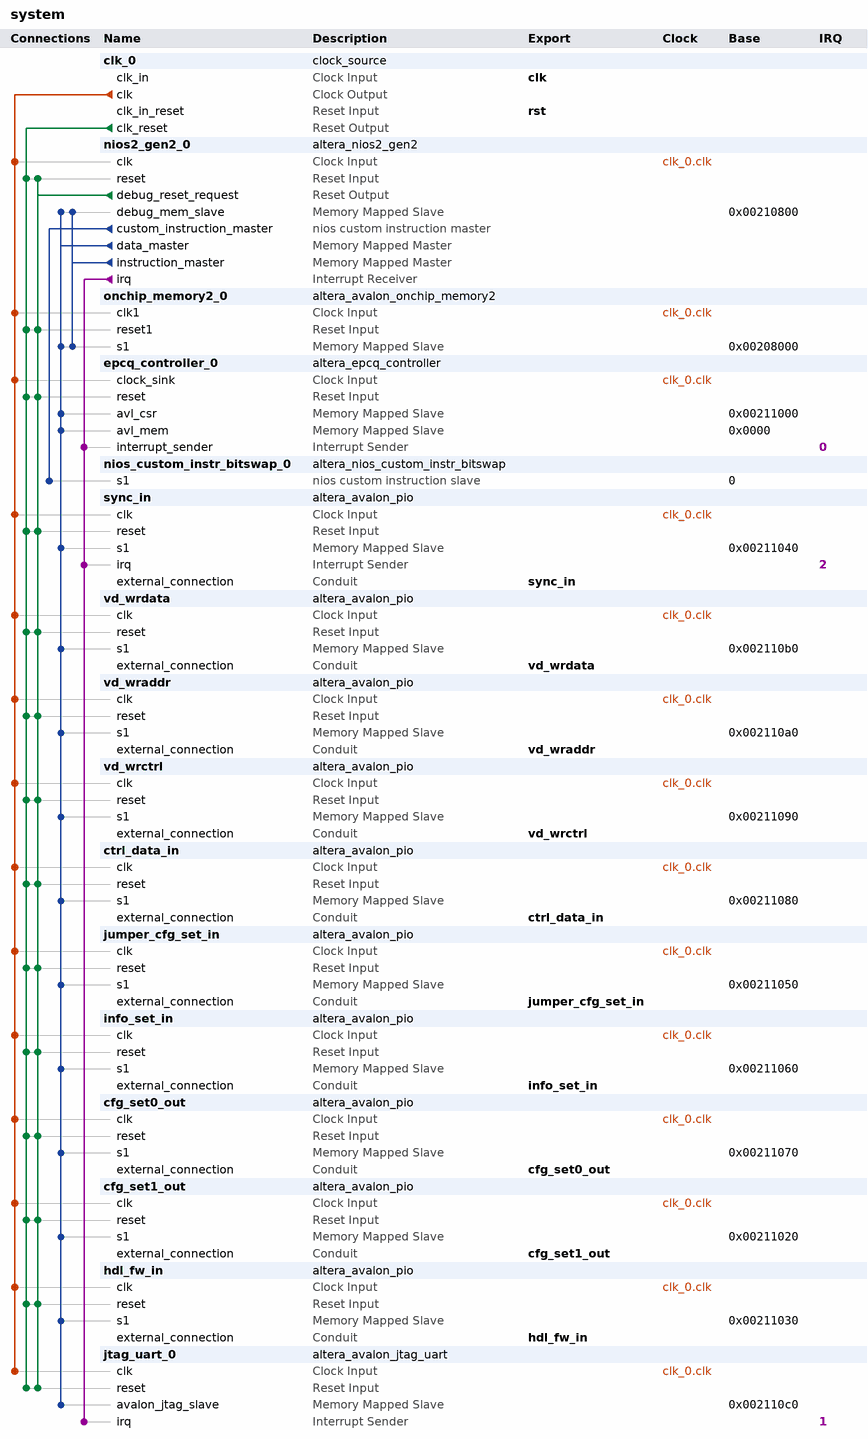
[diagram p0: system contents]
# Platform Designer (Qsys) system system, Cyclone IV E EP4CE10E22C8
# Parameters at their usual value, and those the tool derives, are not listed.
package require -exact qsys 18.1
create_system system
set_project_property DEVICE_FAMILY {Cyclone IV E}
set_project_property DEVICE EP4CE10E22C8

add_instance clk_0 clock_source 18.1
set_instance_parameter_value clk_0 clockFrequency 25000000

add_instance nios2_gen2_0 altera_nios2_gen2 18.1
set_instance_parameter_value nios2_gen2_0 dcache_size 2048
set_instance_parameter_value nios2_gen2_0 exceptionSlave onchip_memory2_0.s1
set_instance_parameter_value nios2_gen2_0 icache_size 4096
set_instance_parameter_value nios2_gen2_0 impl Tiny
set_instance_parameter_value nios2_gen2_0 resetSlave onchip_memory2_0.s1

add_instance onchip_memory2_0 altera_avalon_onchip_memory2 18.1
set_instance_parameter_value onchip_memory2_0 dataWidth 32
set_instance_parameter_value onchip_memory2_0 dualPort false
set_instance_parameter_value onchip_memory2_0 initMemContent true
set_instance_parameter_value onchip_memory2_0 initializationFileName software/n64adv1/controller_app/mem_init/system_onchip_memory2_0.hex
set_instance_parameter_value onchip_memory2_0 memorySize 28672
set_instance_parameter_value onchip_memory2_0 useNonDefaultInitFile true

add_instance epcq_controller_0 altera_epcq_controller 18.1
set_instance_parameter_value epcq_controller_0 CHIP_SELS 1
set_instance_parameter_value epcq_controller_0 DDASI 0
set_instance_parameter_value epcq_controller_0 FLASH_TYPE EPCS16
set_instance_parameter_value epcq_controller_0 IO_MODE STANDARD
set_instance_parameter_value epcq_controller_0 UNIQUE_ID {$${FILENAME}_epcq_controller_0}
set_instance_parameter_value epcq_controller_0 clkFreq 25000000

add_instance nios_custom_instr_bitswap_0 altera_nios_custom_instr_bitswap 18.1

add_instance sync_in altera_avalon_pio 18.1
set_instance_parameter_value sync_in captureEdge true
set_instance_parameter_value sync_in direction Input
set_instance_parameter_value sync_in generateIRQ true
set_instance_parameter_value sync_in irqType EDGE
set_instance_parameter_value sync_in width 2

add_instance vd_wrdata altera_avalon_pio 18.1
set_instance_parameter_value vd_wrdata direction Output
set_instance_parameter_value vd_wrdata width 13

add_instance vd_wraddr altera_avalon_pio 18.1
set_instance_parameter_value vd_wraddr direction Output
set_instance_parameter_value vd_wraddr width 10

add_instance vd_wrctrl altera_avalon_pio 18.1
set_instance_parameter_value vd_wrctrl direction Output
set_instance_parameter_value vd_wrctrl width 2

add_instance ctrl_data_in altera_avalon_pio 18.1
set_instance_parameter_value ctrl_data_in direction Input
set_instance_parameter_value ctrl_data_in width 32

add_instance jumper_cfg_set_in altera_avalon_pio 18.1
set_instance_parameter_value jumper_cfg_set_in direction Input
set_instance_parameter_value jumper_cfg_set_in width 8

add_instance info_set_in altera_avalon_pio 18.1
set_instance_parameter_value info_set_in direction Input
set_instance_parameter_value info_set_in width 8

add_instance cfg_set0_out altera_avalon_pio 18.1
set_instance_parameter_value cfg_set0_out direction Output
set_instance_parameter_value cfg_set0_out width 32

add_instance cfg_set1_out altera_avalon_pio 18.1
set_instance_parameter_value cfg_set1_out direction Output
set_instance_parameter_value cfg_set1_out width 32

add_instance hdl_fw_in altera_avalon_pio 18.1
set_instance_parameter_value hdl_fw_in direction Input
set_instance_parameter_value hdl_fw_in width 12

add_instance jtag_uart_0 altera_avalon_jtag_uart 18.1
set_instance_parameter_value jtag_uart_0 simInteractiveOptions NO_INTERACTIVE_WINDOWS
set_instance_parameter_value jtag_uart_0 useRegistersForReadBuffer true

# connections
add_connection clk_0.clk cfg_set0_out.clk clock
add_connection clk_0.clk cfg_set1_out.clk clock
add_connection clk_0.clk ctrl_data_in.clk clock
add_connection clk_0.clk epcq_controller_0.clock_sink clock
add_connection clk_0.clk hdl_fw_in.clk clock
add_connection clk_0.clk info_set_in.clk clock
add_connection clk_0.clk jtag_uart_0.clk clock
add_connection clk_0.clk jumper_cfg_set_in.clk clock
add_connection clk_0.clk nios2_gen2_0.clk clock
add_connection clk_0.clk onchip_memory2_0.clk1 clock
add_connection clk_0.clk sync_in.clk clock
add_connection clk_0.clk vd_wraddr.clk clock
add_connection clk_0.clk vd_wrctrl.clk clock
add_connection clk_0.clk vd_wrdata.clk clock
add_connection clk_0.clk_reset cfg_set0_out.reset reset
add_connection clk_0.clk_reset cfg_set1_out.reset reset
add_connection clk_0.clk_reset ctrl_data_in.reset reset
add_connection clk_0.clk_reset epcq_controller_0.reset reset
add_connection clk_0.clk_reset hdl_fw_in.reset reset
add_connection clk_0.clk_reset info_set_in.reset reset
add_connection clk_0.clk_reset jtag_uart_0.reset reset
add_connection clk_0.clk_reset jumper_cfg_set_in.reset reset
add_connection clk_0.clk_reset nios2_gen2_0.reset reset
add_connection clk_0.clk_reset onchip_memory2_0.reset1 reset
add_connection clk_0.clk_reset sync_in.reset reset
add_connection clk_0.clk_reset vd_wraddr.reset reset
add_connection clk_0.clk_reset vd_wrctrl.reset reset
add_connection clk_0.clk_reset vd_wrdata.reset reset
add_connection nios2_gen2_0.debug_reset_request cfg_set0_out.reset reset
add_connection nios2_gen2_0.debug_reset_request cfg_set1_out.reset reset
add_connection nios2_gen2_0.debug_reset_request ctrl_data_in.reset reset
add_connection nios2_gen2_0.debug_reset_request epcq_controller_0.reset reset
add_connection nios2_gen2_0.debug_reset_request hdl_fw_in.reset reset
add_connection nios2_gen2_0.debug_reset_request info_set_in.reset reset
add_connection nios2_gen2_0.debug_reset_request jtag_uart_0.reset reset
add_connection nios2_gen2_0.debug_reset_request jumper_cfg_set_in.reset reset
add_connection nios2_gen2_0.debug_reset_request nios2_gen2_0.reset reset
add_connection nios2_gen2_0.debug_reset_request onchip_memory2_0.reset1 reset
add_connection nios2_gen2_0.debug_reset_request sync_in.reset reset
add_connection nios2_gen2_0.debug_reset_request vd_wraddr.reset reset
add_connection nios2_gen2_0.debug_reset_request vd_wrctrl.reset reset
add_connection nios2_gen2_0.debug_reset_request vd_wrdata.reset reset
add_connection nios2_gen2_0.data_master cfg_set0_out.s1 avalon
set_connection_parameter_value nios2_gen2_0.data_master/cfg_set0_out.s1 baseAddress 0x00211070
add_connection nios2_gen2_0.data_master cfg_set1_out.s1 avalon
set_connection_parameter_value nios2_gen2_0.data_master/cfg_set1_out.s1 baseAddress 0x00211020
add_connection nios2_gen2_0.data_master ctrl_data_in.s1 avalon
set_connection_parameter_value nios2_gen2_0.data_master/ctrl_data_in.s1 baseAddress 0x00211080
add_connection nios2_gen2_0.data_master epcq_controller_0.avl_csr avalon
set_connection_parameter_value nios2_gen2_0.data_master/epcq_controller_0.avl_csr baseAddress 0x00211000
add_connection nios2_gen2_0.data_master epcq_controller_0.avl_mem avalon
set_connection_parameter_value nios2_gen2_0.data_master/epcq_controller_0.avl_mem baseAddress 0x0000
add_connection nios2_gen2_0.data_master hdl_fw_in.s1 avalon
set_connection_parameter_value nios2_gen2_0.data_master/hdl_fw_in.s1 baseAddress 0x00211030
add_connection nios2_gen2_0.data_master info_set_in.s1 avalon
set_connection_parameter_value nios2_gen2_0.data_master/info_set_in.s1 baseAddress 0x00211060
add_connection nios2_gen2_0.data_master jtag_uart_0.avalon_jtag_slave avalon
set_connection_parameter_value nios2_gen2_0.data_master/jtag_uart_0.avalon_jtag_slave baseAddress 0x002110c0
add_connection nios2_gen2_0.data_master jumper_cfg_set_in.s1 avalon
set_connection_parameter_value nios2_gen2_0.data_master/jumper_cfg_set_in.s1 baseAddress 0x00211050
add_connection nios2_gen2_0.data_master nios2_gen2_0.debug_mem_slave avalon
set_connection_parameter_value nios2_gen2_0.data_master/nios2_gen2_0.debug_mem_slave baseAddress 0x00210800
add_connection nios2_gen2_0.data_master onchip_memory2_0.s1 avalon
set_connection_parameter_value nios2_gen2_0.data_master/onchip_memory2_0.s1 baseAddress 0x00208000
add_connection nios2_gen2_0.data_master sync_in.s1 avalon
set_connection_parameter_value nios2_gen2_0.data_master/sync_in.s1 baseAddress 0x00211040
add_connection nios2_gen2_0.data_master vd_wraddr.s1 avalon
set_connection_parameter_value nios2_gen2_0.data_master/vd_wraddr.s1 baseAddress 0x002110a0
add_connection nios2_gen2_0.data_master vd_wrctrl.s1 avalon
set_connection_parameter_value nios2_gen2_0.data_master/vd_wrctrl.s1 baseAddress 0x00211090
add_connection nios2_gen2_0.data_master vd_wrdata.s1 avalon
set_connection_parameter_value nios2_gen2_0.data_master/vd_wrdata.s1 baseAddress 0x002110b0
add_connection nios2_gen2_0.instruction_master nios2_gen2_0.debug_mem_slave avalon
set_connection_parameter_value nios2_gen2_0.instruction_master/nios2_gen2_0.debug_mem_slave baseAddress 0x00210800
add_connection nios2_gen2_0.instruction_master onchip_memory2_0.s1 avalon
set_connection_parameter_value nios2_gen2_0.instruction_master/onchip_memory2_0.s1 baseAddress 0x00208000
add_connection nios2_gen2_0.irq epcq_controller_0.interrupt_sender interrupt
set_connection_parameter_value nios2_gen2_0.irq/epcq_controller_0.interrupt_sender irqNumber 0
add_connection nios2_gen2_0.irq jtag_uart_0.irq interrupt
set_connection_parameter_value nios2_gen2_0.irq/jtag_uart_0.irq irqNumber 1
add_connection nios2_gen2_0.irq sync_in.irq interrupt
set_connection_parameter_value nios2_gen2_0.irq/sync_in.irq irqNumber 2
add_connection nios2_gen2_0.custom_instruction_master nios_custom_instr_bitswap_0.s1 nios_custom_instruction
set_connection_parameter_value nios2_gen2_0.custom_instruction_master/nios_custom_instr_bitswap_0.s1 CIName nios_custom_instr_bitswap_0
set_connection_parameter_value nios2_gen2_0.custom_instruction_master/nios_custom_instr_bitswap_0.s1 baseAddress 0

# exported interfaces
add_interface cfg_set0_out conduit end
set_interface_property cfg_set0_out EXPORT_OF cfg_set0_out.external_connection
add_interface cfg_set1_out conduit end
set_interface_property cfg_set1_out EXPORT_OF cfg_set1_out.external_connection
add_interface clk clock sink
set_interface_property clk EXPORT_OF clk_0.clk_in
add_interface ctrl_data_in conduit end
set_interface_property ctrl_data_in EXPORT_OF ctrl_data_in.external_connection
add_interface hdl_fw_in conduit end
set_interface_property hdl_fw_in EXPORT_OF hdl_fw_in.external_connection
add_interface info_set_in conduit end
set_interface_property info_set_in EXPORT_OF info_set_in.external_connection
add_interface jumper_cfg_set_in conduit end
set_interface_property jumper_cfg_set_in EXPORT_OF jumper_cfg_set_in.external_connection
add_interface rst reset sink
set_interface_property rst EXPORT_OF clk_0.clk_in_reset
add_interface sync_in conduit end
set_interface_property sync_in EXPORT_OF sync_in.external_connection
add_interface vd_wraddr conduit end
set_interface_property vd_wraddr EXPORT_OF vd_wraddr.external_connection
add_interface vd_wrctrl conduit end
set_interface_property vd_wrctrl EXPORT_OF vd_wrctrl.external_connection
add_interface vd_wrdata conduit end
set_interface_property vd_wrdata EXPORT_OF vd_wrdata.external_connection

set_interconnect_requirement {$system} qsys_mm.clockCrossingAdapter HANDSHAKE
set_interconnect_requirement {$system} qsys_mm.enableEccProtection FALSE
set_interconnect_requirement {$system} qsys_mm.insertDefaultSlave FALSE
set_interconnect_requirement {$system} qsys_mm.maxAdditionalLatency 1

save_system system.qsys
